# EasyEDA Pro project 舵机电源.epro

# Schematic steering_engine_driver
Board Name: steering_engine_driver; Create Date: 2025-04-19; Page Name: P1; Project Name: wheel_legged_robot_v7.0; Schematic Name: steering_engine_driver; Update Date: 2025-04-19; Company: 嘉立创EDA; Page Size: A4; Version: V1.0
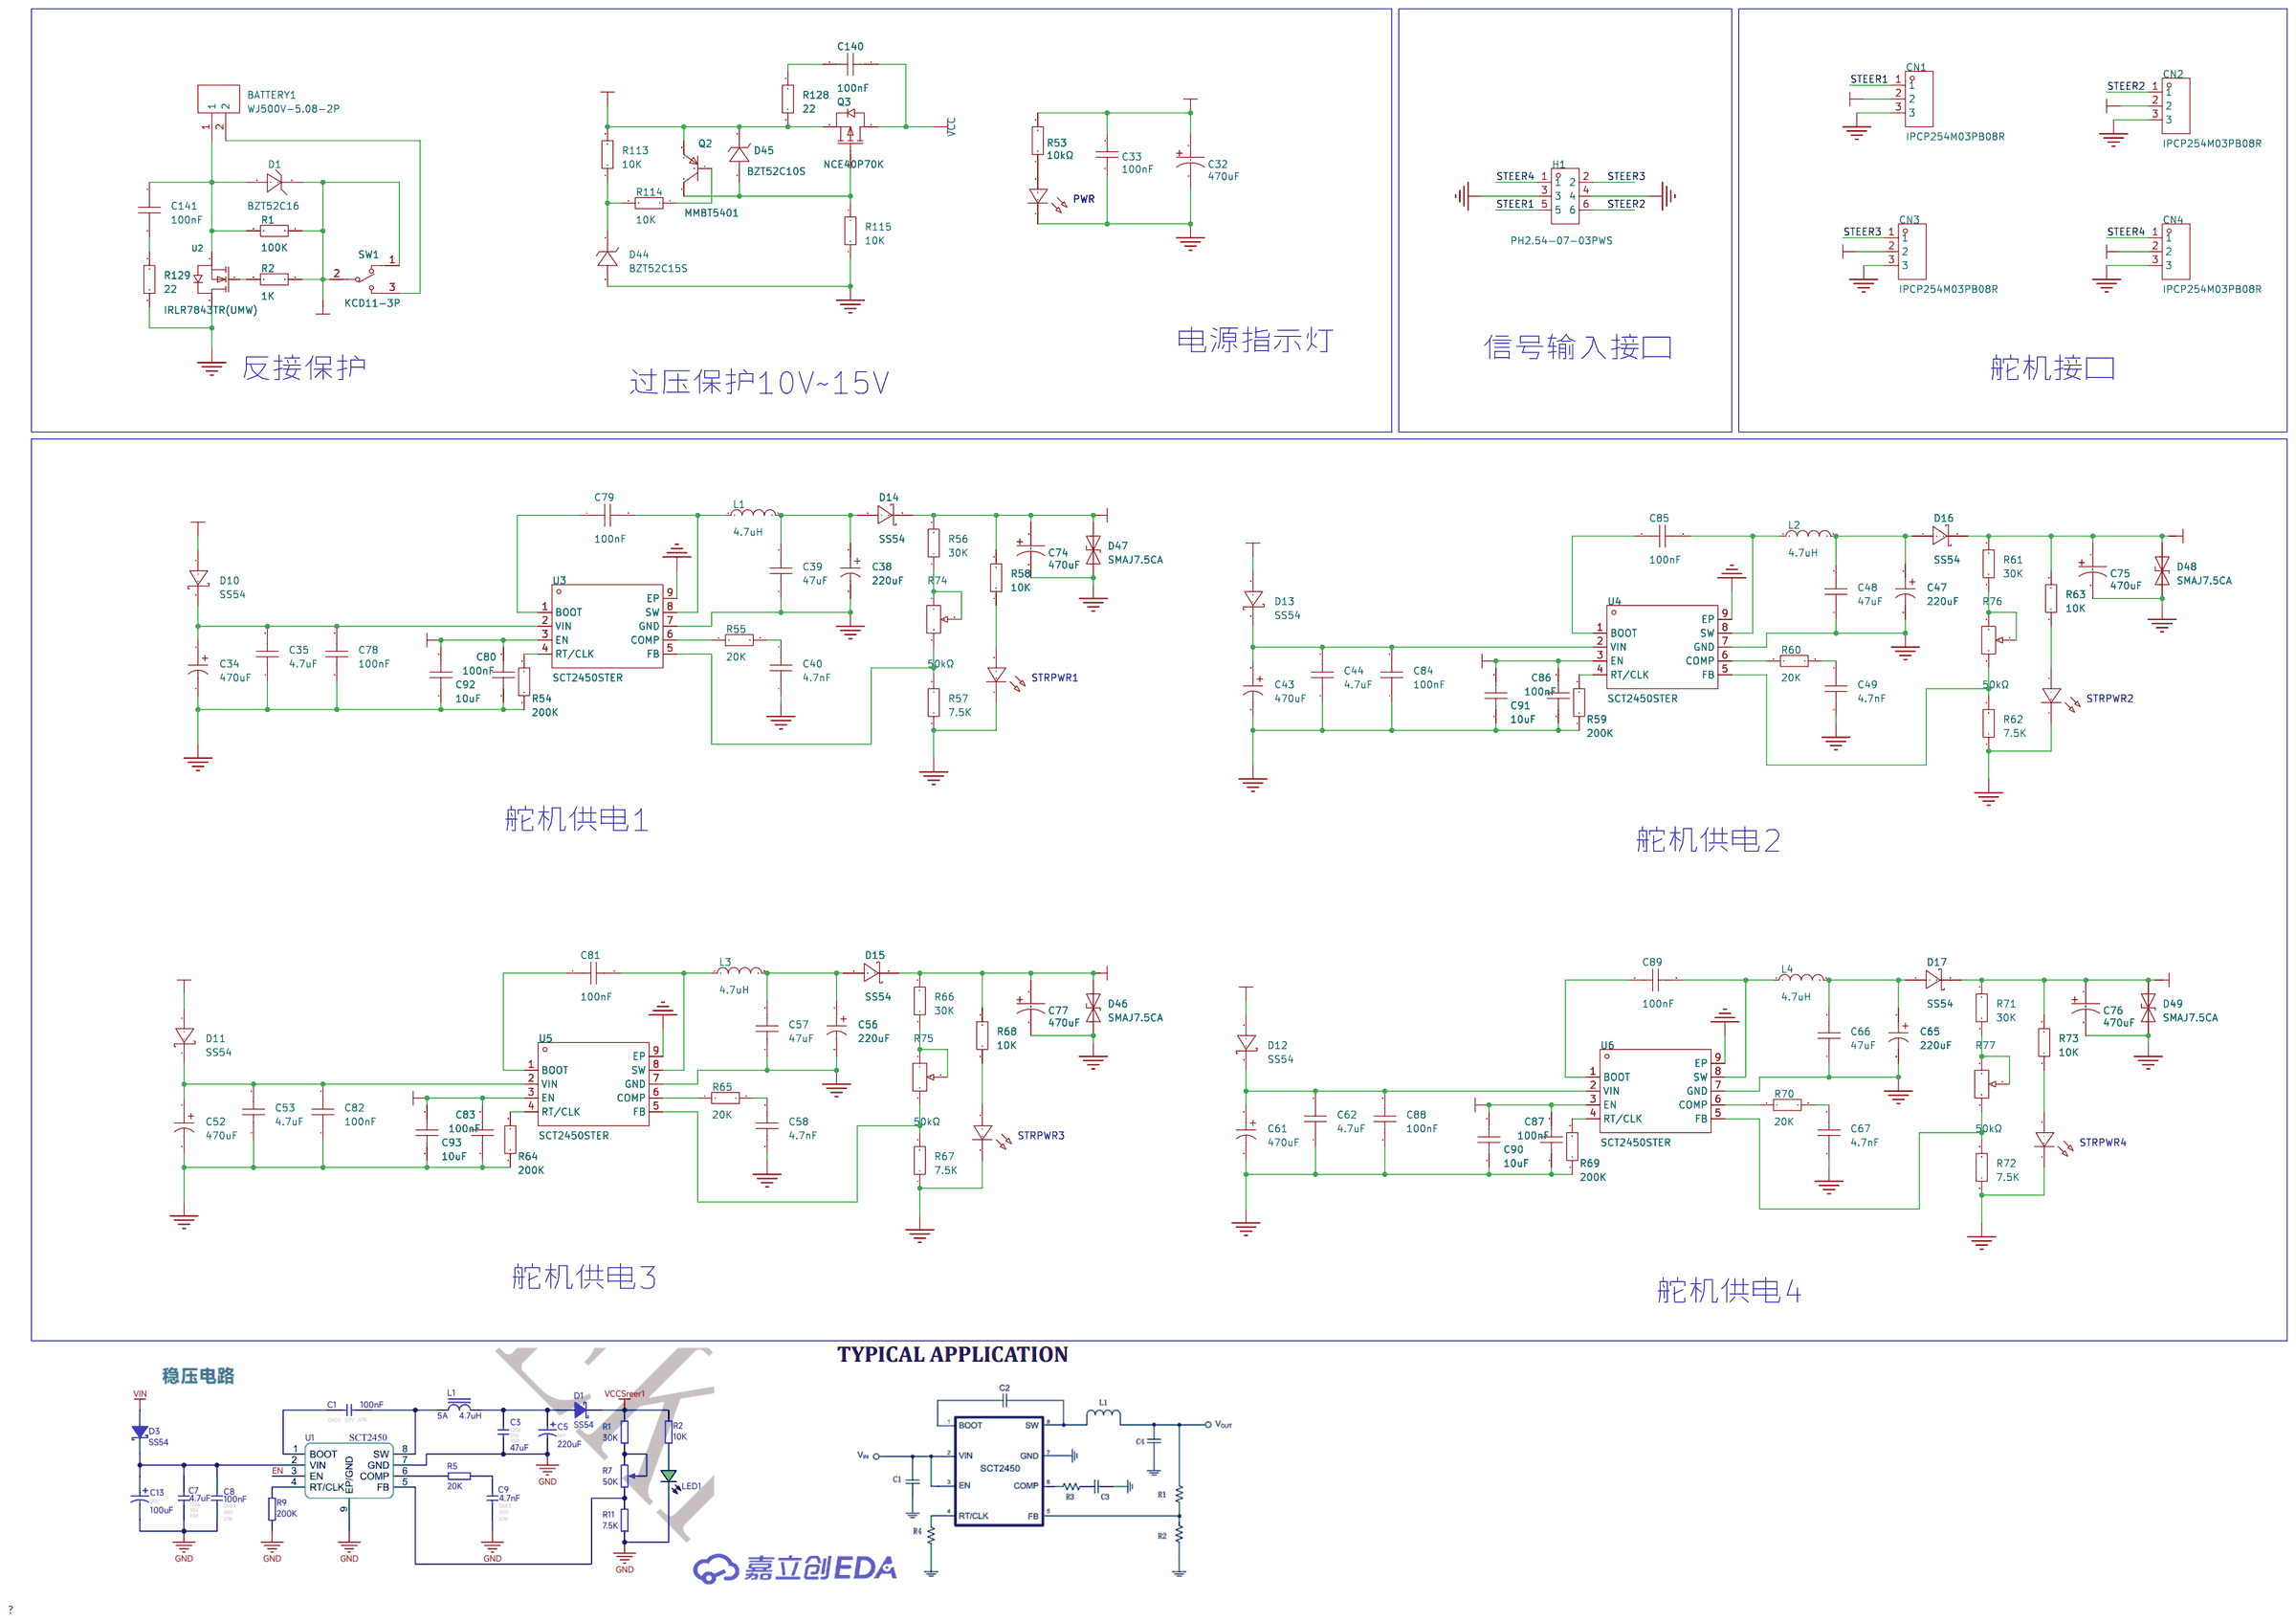
[diagram p0: schematic sheet]

## Parts
BATTERY1  WJ500V-5.08-2P  [CONN-TH_2P-P5.00_WJ500V-5.08-2P]
C32  470uF  [CAP-TH_BD8.0-P3.50-D0.6-FD]
C33  100nF  [C0805]
C34  470uF  [CAP-SMD_BD8.0-L8.3-W8.3-FD]
C35  4.7uF  [C1206]
C38  220uF  [CAP-SMD_BD8.0-L8.3-W8.3-FD]
C39  47uF  [C1206]
C40  4.7nF  [C0603]
C43  470uF  [CAP-SMD_BD8.0-L8.3-W8.3-FD]
C44  4.7uF  [C1206]
C47  220uF  [CAP-SMD_BD8.0-L8.3-W8.3-FD]
C48  47uF  [C1206]
C49  4.7nF  [C0603]
C52  470uF  [CAP-SMD_BD8.0-L8.3-W8.3-FD]
C53  4.7uF  [C1206]
C56  220uF  [CAP-SMD_BD8.0-L8.3-W8.3-FD]
C57  47uF  [C1206]
C58  4.7nF  [C0603]
C61  470uF  [CAP-SMD_BD8.0-L8.3-W8.3-FD]
C62  4.7uF  [C1206]
C65  220uF  [CAP-SMD_BD8.0-L8.3-W8.3-FD]
C66  47uF  [C1206]
C67  4.7nF  [C0603]
C74  470uF  [CAP-TH_BD8.0-P3.50-D0.6-FD]
C75  470uF  [CAP-TH_BD8.0-P3.50-D0.6-FD]
C76  470uF  [CAP-TH_BD8.0-P3.50-D0.6-FD]
C77  470uF  [CAP-TH_BD8.0-P3.50-D0.6-FD]
C78  100nF  [C0603]
C79  100nF  [C0603]
C80  100nF  [C0603]
C81  100nF  [C0603]
C82  100nF  [C0603]
C83  100nF  [C0603]
C84  100nF  [C0603]
C85  100nF  [C0603]
C86  100nF  [C0603]
C87  100nF  [C0603]
C88  100nF  [C0603]
C89  100nF  [C0603]
C90  10uF  [C0603]
C91  10uF  [C0603]
C92  10uF  [C0603]
C93  10uF  [C0603]
C140  100nF  [C0603]
C141  100nF  [C0603]
CN1  IPCP254M03PB08R  [HDR-TH_3P-P2.54-H-M-W10.4]
CN2  IPCP254M03PB08R  [HDR-TH_3P-P2.54-H-M-W10.4]
CN3  IPCP254M03PB08R  [HDR-TH_3P-P2.54-H-M-W10.4]
CN4  IPCP254M03PB08R  [HDR-TH_3P-P2.54-H-M-W10.4]
D1  BZT52C16  [SOD-123_L2.7-W1.6-LS3.7-RD]
D10  SS54  [SMA_L4.4-W2.8-LS5.4-R-RD]
D11  SS54  [SMA_L4.4-W2.8-LS5.4-R-RD]
D12  SS54  [SMA_L4.4-W2.8-LS5.4-R-RD]
D13  SS54  [SMA_L4.4-W2.8-LS5.4-R-RD]
D14  SS54  [SMA_L4.4-W2.8-LS5.4-R-RD]
D15  SS54  [SMA_L4.4-W2.8-LS5.4-R-RD]
D16  SS54  [SMA_L4.4-W2.8-LS5.4-R-RD]
D17  SS54  [SMA_L4.4-W2.8-LS5.4-R-RD]
D44  BZT52C15S  [SOD-323_L1.7-W1.3-LS2.6-RD]
D45  BZT52C10S  [SOD-323_L1.7-W1.3-LS2.6-RD]
D46  SMAJ7.5CA  [SMA_L4.4-W2.6-LS5.0-BI]
D47  SMAJ7.5CA  [SMA_L4.4-W2.6-LS5.0-BI]
D48  SMAJ7.5CA  [SMA_L4.4-W2.6-LS5.0-BI]
D49  SMAJ7.5CA  [SMA_L4.4-W2.6-LS5.0-BI]
H1  PH2.54-07-03PWS  [HDR-TH_6P-P2.54-H-M-R2-C3-S2.54-W12.3-N]
L1  4.7uH  [IND-SMD_L7.4-W6.6]
L2  4.7uH  [IND-SMD_L7.4-W6.6]
L3  4.7uH  [IND-SMD_L7.4-W6.6]
L4  4.7uH  [IND-SMD_L7.4-W6.6]
PWR  -  [LED_0805]
Q2  MMBT5401  [SOT-23-3_L2.9-W1.3-P1.90-LS2.4-BR]
Q3  NCE40P70K  [TO-252-2_L6.6-W6.1-P4.57-LS9.9-TL-CW]
R1  100K  [R0805]
R2  1K  [R0805]
R53  10kΩ  [R0805]
R54  200K  [R0603]
R55  20K  [R0603]
R56  30K  [R0603]
R57  7.5K  [R0603]
R58  10K  [R0603]
R59  200K  [R0603]
R60  20K  [R0603]
R61  30K  [R0603]
R62  7.5K  [R0603]
R63  10K  [R0603]
R64  200K  [R0603]
R65  20K  [R0603]
R66  30K  [R0603]
R67  7.5K  [R0603]
R68  10K  [R0603]
R69  200K  [R0603]
R70  20K  [R0603]
R71  30K  [R0603]
R72  7.5K  [R0603]
R73  10K  [R0603]
R74  50kΩ  [RES-ADJ-TH_3P-L7.1-W6.9-P2.50-L_3362P]
R75  50kΩ  [RES-ADJ-TH_3P-L7.1-W6.9-P2.50-L_3362P]
R76  50kΩ  [RES-ADJ-TH_3P-L7.1-W6.9-P2.50-L_3362P]
R77  50kΩ  [RES-ADJ-TH_3P-L7.1-W6.9-P2.50-L_3362P]
R113  10K  [R0805]
R114  10K  [R0805]
R115  10K  [R0805]
R128  22  [R0603]
R129  22  [R0603]
STRPWR1  -  [LED_0805]
STRPWR2  -  [LED_0805]
STRPWR3  -  [LED_0805]
STRPWR4  -  [LED_0805]
SW1  KCD11-3P  [KCD11-3P]
U2  IRLR7843TR(UMW)  [TO-252-2_L6.5-W6.1-P4.58-LS10.0-BL]
U3  SCT2450STER  [ESOP-8_L4.9-W3.9-P1.27-LS6.0-BL-EP]
U4  SCT2450STER  [ESOP-8_L4.9-W3.9-P1.27-LS6.0-BL-EP]
U5  SCT2450STER  [ESOP-8_L4.9-W3.9-P1.27-LS6.0-BL-EP]
U6  SCT2450STER  [ESOP-8_L4.9-W3.9-P1.27-LS6.0-BL-EP]

## Library data of the parts
BATTERY1 = WJ500V-5.08-2P: 结构:1x2P;间距:5.08mm;颜色:绿色;安装方式:直插;额定电流:18A;额定电压:250V;排数:1;线规 - AWG:14~30;线规 - 平方毫米:2.5;每排PIN数:2;工作温度范围:-40℃~+105℃;; Supplier: LCSC; Manufacturer: KANGNEX(康奈克斯电气); Supplier Part: C8465; JLCPCB Part Class: 扩展库; LCSC Part Name: 5.08mm 1x2P 排数:1 每排P数:2 直插; Supplier Footprint: 插件,P=5.08mm; Datasheet: https://atta.szlcsc.com/upload/public/pdf/source/20191225/C8465_02D34CE5B5B4A53DF5891601D97FA9F4.pdf; Structure: 1x2P; Pitch: 5.08mm; Color: 绿色; Mounting Style: 直插; Current Rating (Max): 18A; Voltage Rating (Max): 250V; Number of Pins: 2P; Number of Rows: 1; Wire Gauge - AWG: 14~30; Wire Gauge - mm2: 2.5; Number of PINs Per Row: 2; Operating Temperature Range: -40℃~+105℃
C32 C74-C77 = 470uF: link: https://atta.szlcsc.com/upload/public/pdf/source/20151029/1457707523808.pdf; 3DModel: CAP-TH_D8.0-H8.0-P3.50; Supplier: LCSC; Manufacturer: HONOR(荣誉); Manufacturer Part: HS1C477M0811PC; Supplier Part: C42238; JLCPCB Part Class: Extended Part
C33 = 100nF: link: https://item.szlcsc.com/373011.html; 3DModel: C0805_L2.0-W1.3-H1.3; Supplier: LCSC; Manufacturer Part: CC0805KRX7R9BB104; Manufacturer: YAGEO(国巨); Supplier Part: C49678; JLCPCB Part Class: Basic Part
C34 C38 C43 C47 C52 C56 C61 C65 = RST470UF25V032: 容值:470uF;精度:±20%;额定电压:25V;纹波电流:280mA@120Hz;等效串联电阻:-;; LCSC Part Name: 470uF ±20% 25V; Supplier Part: C4747956; Manufacturer: KNSCHA(科尼盛); Supplier Footprint: SMD,D8xL10.5mm; JLCPCB Part Class: 扩展库; Datasheet: https://atta.szlcsc.com/upload/public/pdf/source/20220722/DDA0AF558EEAFF68270B01FAD3D9C996.pdf; Supplier: LCSC; Tolerance: ±20%; Rated Voltage: 25V; Ripple Current: 280mA@120Hz; φD: 8mm; L: 10.5mm; Lifetime @ Temp: 2000hrs@105℃; Operating Temperature: -40℃~+105℃
C35 C39 C44 C48 C53 C57 C62 C66 = CAP_1206: Supplier Footprint: 1206
C40 C49 C58 C67 C78-C93 = CAP_0603: Supplier Footprint: 0603
C140 C141 = CAP_0603: Supplier Footprint: 0805
CN1-CN4 = IPCP254M03PB08R: 插针结构:1x3P;间距:2.54mm;圆针/方针:方针;安装类型:弯插;排数:单排;总PIN位数:3P;额定电流:3A;额定电压:-;塑高:2.5mm;触头材质:黄铜;触头镀层:金;工作温度范围:-40℃~+105℃;颜色:黑色;; LCSC Part Name: 1x3P 间距:2.54mm 方针 弯插; Supplier Part: C22395593; Manufacturer: INCP; Supplier Footprint: 弯插,P=2.54mm; JLCPCB Part Class: 扩展库; Datasheet: https://atta.szlcsc.com/upload/public/pdf/source/20240509/0D0900A9017CC8912FD60234744B7849.pdf; Supplier: LCSC; Pin Structure: 1x3P; Pitch: 2.54mm; Circluar Pins/Square Pins: 方针; Mounting Type: 弯插; Number of Rows: 单排; Number of Pins: 3P; Current Rating (Max): 3A; Insulation Height: 2.5mm; Contact Material: 黄铜; Contact Plating: 金; Operating Temperature Range: -40℃~+105℃; Color: 黑色
D1 = BZT52C16_C266570: 二极管配置:独立式;稳压值(标称值):16V;稳压值(范围):15.3V~17.1V;功率:500mW;精度:-;; Supplier Part: C266570; Manufacturer: BORN(伯恩半导体); Supplier Footprint: SOD-123; JLCPCB Part Class: 扩展库; Datasheet: https://atta.szlcsc.com/upload/public/pdf/source/20180820/C271262_D2D0F24DD5A81EAE2A6B8B493A94E64A.pdf; Supplier: LCSC; Diode Configuration: 独立式; Zener Voltage (Nom): 16V; Reverse Leakage Current (Ir): 100nA@11.2V; Zener Voltage (Range): 15.3V~17.1V; Power Dissipation: 500mW; Zener Impedance (Zzt): 40Ω
D10-D17 = SS54_C22452: 二极管配置:独立式;正向压降(Vf):550mV@5A;直流反向耐压(Vr):40V;整流电流:5A;; LCSC Part Name: 电压:40V 电流:5A; Supplier Part: C22452; Manufacturer: MDD(辰达半导体); Supplier Footprint: SMA(DO-214AC); JLCPCB Part Class: 基础库; Datasheet: https://atta.szlcsc.com/upload/public/pdf/source/20240710/73DFBB65C1883B895E62D589679033DF.pdf; Supplier: LCSC; Diode Configuration: 独立式; Forward Voltage (Vf@If): 550mV@5A; Reverse Voltage (Vr): 40V; Rectified Current: 5A; Reverse Leakage Current (Ir): 1mA@40V
D44 = BZT52C15S_C19077448: 二极管配置:独立式;稳压值(标称值):15V;稳压值(范围):13.8V~15.6V;功率(Pd):200mW;; Supplier Part: C19077448; Manufacturer: 宏迦橙; Supplier Footprint: SOD-323; JLCPCB Part Class: 扩展库; Datasheet: https://atta.szlcsc.com/upload/public/pdf/source/20231117/06CD1C2A69B3FFC97FEAE4263E1B2FE9.pdf; Supplier: LCSC; Diode Configuration: 独立式; Zener Voltage (Nom): 15V; Reverse Leakage Current (Ir): 100nA@10.5V; Zener Voltage (Range): 13.8V~15.6V; Power Dissipation: 200mW; Zener Impedance (Zzt): 30Ω
D45 = BZT52C10S_C19077446: 二极管配置:独立式;稳压值(标称值):10V;稳压值(范围):9.4V~10.6V;耗散功率(Pd):200mW;; Supplier Part: C19077446; Manufacturer: 宏嘉诚; Supplier Footprint: SOD-323; Datasheet: https://atta.szlcsc.com/upload/public/pdf/source/20250106/7E1D90346C4882705F28E5010261A625.pdf; Supplier: LCSC; Diode Configuration: 独立式; Zener Voltage(Nom): 10V; Reverse Leakage Current (Ir): 200nA@7V; Zener Voltage(Range): 9.4V~10.6V; Pd - Power Dissipation(Pd): 200mW; Impedance(Zzt): 20Ω
D46-D49 = SMAJ7.5CA: 反向截止电压(Vrwm):7.5V;最大钳位电压:12.9V;峰值脉冲电流(Ipp):31A;击穿电压:8.33V;; LCSC Part Name: 双向TVS 7.5V截止 31A峰值脉冲; Supplier Part: C356752; Manufacturer: JJW(捷捷微); Supplier Footprint: SMA(DO-214AC); Datasheet: https://atta.szlcsc.com/upload/public/pdf/source/20190118/C364660_B64EB57815AD6306F3CC88F8ECD7A3CF.pdf; Supplier: LCSC; Reverse Stand-Off Voltage (Vrwm): 7.5V; Maximum Clamping Voltage: 12.9V; Peak Pulse Current (Ipp): 31A; Breakdown Voltage: 8.33V; Reverse Leakage Current (Ir): 50uA; Type: TVS
H1 = PH2.54-07-03PWS: 插针结构:2x3P;间距:2.54mm;圆针/方针:方针;安装类型:弯插;排数:双排;总PIN位数:6P;配合针长度:6mm;塑高:2.5mm;触头材质:黄铜;工作温度范围:-40℃~+105℃;颜色:黑色;; LCSC Part Name: 2x3P 间距:2.54mm 方针 弯插; Supplier Part: C7501617; Manufacturer: XUNPU(讯普); Supplier Footprint: 弯插,P=2.54mm; Datasheet: https://atta.szlcsc.com/upload/public/pdf/source/20230815/3BBD1229DF6C13ABF62022728673B9BB.pdf; Supplier: LCSC; Pin Structure: 2x3P; Pitch: 2.54mm; Circluar Pins/Square Pins: 方针; Mounting Type: 弯插; Number of Rows: 双排; Number of Pins: 6P; Length of Mating Pin: 6mm; Insulation Height: 2.5mm; Contact Material: 黄铜; Operating Temperature Range: -40℃~+105℃; Color: 黑色
L1-L4 = HMS0603-4R7: 电感值:4.7uH;精度:-;额定电流:5.5A;饱和电流(Isat):6.5A;类型:一体成型电感;; LCSC Part Name: 4.7uH 6.5A; Supplier Part: C967698; Manufacturer: 增益; Supplier Footprint: SMD,7.4x6.6mm; JLCPCB Part Class: 扩展库; Datasheet: https://atta.szlcsc.com/upload/public/pdf/source/20210225/C967698_0CB36CDEAF6345E0CAE8D00497A63C4A.pdf; Supplier: LCSC; Rated Current: 5.5A; Saturation Current (Isat): 6.5A; DC Resistance (DCR): 38mΩ; Type: 一体成型电感
PWR STRPWR1-STRPWR4 = LED_0805-G: Supplier Footprint: 0805
Q2 = MMBT5401_C7420356: 晶体管类型:PNP;集电极电流(Ic):600mA;集射极击穿电压(Vceo):160V;耗散功率(Pd):300mW;直流电流增益(hFE):100@10mA,5.0V;; LCSC Part Name: hFE:100-300 MMBT5401; Supplier Part: C7420356; Manufacturer: 宏嘉诚; Supplier Footprint: SOT-23; JLCPCB Part Class: 扩展库; Datasheet: https://atta.szlcsc.com/upload/public/pdf/source/20250205/4872AD2745041BE7314444031B314746.pdf; Supplier: LCSC; type: PNP; Current - Collector(Ic): 600mA; Collector - Emitter Voltage VCEO: 160V; Pd - Power Dissipation: 300mW; DC Current Gain: 100@10mA,5.0V; Transition frequency(fT): 100MHz; Current - Collector Cutoff: 100nA; Vce Saturation(VCE(sat)): 200mV; Operating Temperature: -55℃~+150℃
Q3 = NCE40P70K: 类型:1个P沟道;漏源电压(Vdss):40V;连续漏极电流(Id):70A;导通电阻(RDS(on)):10mΩ@10V,20A;耗散功率(Pd):130W;阈值电压(Vgs(th)):1.9V;; LCSC Part Name: 1个P沟道 耐压:40V 电流:70A; Supplier Part: C130101; Manufacturer: NCE(无锡新洁能); Supplier Footprint: TO-252-2(DPAK); JLCPCB Part Class: 扩展库; Datasheet: https://atta.szlcsc.com/upload/public/pdf/source/20170919/C130101_1505787178833976874.pdf; Supplier: LCSC; Type: 1个P沟道; Drain to Source Voltage: 40V; Current - Continuous Drain(Id): 70A; RDS(on): 10mΩ@10V,20A; Pd - Power Dissipation: 130W; Gate Threshold Voltage (Vgs(th)@Id): 1.9V; Input Capacitance(Ciss@Vds): 5.38nF@20V; Reverse Transfer Capacitance (Crss@Vds): 500pF; Operating Temperature: -55℃~+150℃
R1 R2 R113-R115 = Res_0805: Supplier Footprint: 0805
R53 = 10kΩ: link: https://item.szlcsc.com/142685.html; 3DModel: R0805_L2.0-W1.3-H0.6; Supplier: LCSC; Manufacturer: UNI-ROYAL(厚声); Manufacturer Part: 0805W8F1002T5E; Supplier Part: C17414; JLCPCB Part Class: Basic Part
R54-R73 = Res_0603: Supplier Footprint: 0603
R74-R77 = 3362P-1-503: 阻值:50kΩ;精度:±10%;; LCSC Part Name: 50kΩ ±10%; Supplier Part: C118910; Manufacturer: BOCHEN(博晨); Supplier Footprint: 插件; JLCPCB Part Class: 扩展库; Datasheet: https://atta.szlcsc.com/upload/public/pdf/source/20171114/C118910_15106326554621117400.pdf; Supplier: LCSC; Tolerance: ±10%
R128 R129 = Res_0603: Supplier Footprint: 0805
SW1 = KCD11-3P
U2 = IRLR7843TR(UMW): Supplier Part: C7499399; Manufacturer: UMW(友台半导体); Supplier Footprint: TO-252; Datasheet: https://atta.szlcsc.com/upload/public/pdf/source/20231109/092A516F619CFFA4C30AC0DEF7D9D9F4.pdf; Supplier: LCSC
U3-U6 = SCT2450STER: 功能类型:降压型;工作电压:3.8V~36V;输出电流:5A;; LCSC Part Name: 3.8V-36V输入，5A输出，高效率同步降压DC-DC转换器; Supplier Part: C509400; Manufacturer: SCT(芯洲科技); Supplier Footprint: ESOP-8; JLCPCB Part Class: 扩展库; Datasheet: https://atta.szlcsc.com/upload/public/pdf/source/20200407/C509400_EDF779A672A59398CFBA9E95FA584FEC.pdf; Supplier: LCSC; Function: 降压型; Input Voltage: 3.8V~36V; Output Current: 5A; Switching Frequency: 100kHz~1.1MHz; Operating Temperature: -40℃~+125℃@(TJ); Synchronous Rectification: 是; Number of Outputs: 1; Switch tube (built-in/external): 内置

## Nets
GND: C32.2 C33.1 C34.2 C35.1 C38.2 C39.1 C40.1 C43.2 C44.1 C47.2 C48.1 C49.1 C52.2 C53.1 C56.2 C57.1 C58.1 C61.2 C62.1 C65.2 C66.1 C67.1 C74.2 C75.2 C76.2 C77.2 C78.1 C80.1 C82.1 C83.1 C84.1 C86.1 C87.1 C88.1 C90.1 C91.1 C92.1 C93.1 CN1.3 CN2.3 CN3.3 CN4.3 D44.2(A) D46.1(K) D47.1(K) D48.1(K) D49.1(K) H1.3 H1.4 PWR.1(C) R54.1 R57.1 R59.1 R62.1 R64.1 R67.1 R69.1 R72.1 R115.2 R129.2 STRPWR1.1(C) STRPWR2.1(C) STRPWR3.1(C) STRPWR4.1(C) U2.2(D) U3.7(GND) U3.9(EP) U4.7(GND) U4.9(EP) U5.7(GND) U5.9(EP) U6.7(GND) U6.9(EP)
VCC: C32.1 C33.2 C80.2 C83.2 C86.2 C87.2 C90.2 C91.2 C92.2 C93.2 C140.1 D10.1(A) D11.1(A) D12.1(A) D13.1(A) Q3.2(D) R53.2 U3.3(EN) U4.3(EN) U5.3(EN) U6.3(EN)
VCCBAT: D1.1 D45.1(K) Q2.2(E) Q3.3(S) R1.2 R2.2 R113.2 R128.2 SW1.1 SW1.2
VCCSTEER1: C74.1 CN1.2 D14.2(K) D47.2(A) R56.2 R58.2
VCCSTEER2: C75.1 CN2.2 D16.2(K) D48.2(A) R61.2 R63.2
VCCSTEER3: C77.1 CN3.2 D15.2(K) D46.2(A) R66.2 R68.2
VCCSTEER4: C76.1 CN4.2 D17.2(K) D49.2(A) R71.2 R73.2
STEER1: CN1.1 H1.5
STEER2: CN2.1 H1.6
STEER3: CN3.1 H1.2
STEER4: CN4.1 H1.1
$1N401: PWR.2(A) R53.1
$1N405: R2.1 U2.1(G)
$1N407: BATTERY1.1 C141.1 D1.2 R1.1 U2.3(S)
$1N408: BATTERY1.2 SW1.3
$1N1540: R54.2 U3.4(RT/CLK)
$1N1581: C79.1 U3.1(BOOT)
$1N1587: C79.2 L1.1 U3.8(SW)
$1N1783: C38.1 C39.2 D14.1(A) L1.2
$1N1881: R55.1 U3.6(COMP)
$1N2036: C40.2 R55.2
$1N2040: R57.2 R74.3 U3.5(FB)
$1N2151: R58.1 STRPWR1.2(A)
$1N2280: R56.1 R74.1 R74.2
$1N2319: C34.1 C35.2 C78.2 D10.2(K) U3.2(VIN)
$1N3136: R59.2 U4.4(RT/CLK)
$1N3138: C85.1 U4.1(BOOT)
$1N3142: C85.2 L2.1 U4.8(SW)
$1N3154: C47.1 C48.2 D16.1(A) L2.2
$1N3159: R60.1 U4.6(COMP)
$1N3163: C49.2 R60.2
$1N3165: R62.2 R76.3 U4.5(FB)
$1N3182: R63.1 STRPWR2.2(A)
$1N3186: R61.1 R76.1 R76.2
$1N3195: C43.1 C44.2 C84.2 D13.2(K) U4.2(VIN)
$1N3910: R64.2 U5.4(RT/CLK)
$1N3912: C81.1 U5.1(BOOT)
$1N3916: C81.2 L3.1 U5.8(SW)
$1N3928: C56.1 C57.2 D15.1(A) L3.2
$1N3933: R65.1 U5.6(COMP)
$1N3937: C58.2 R65.2
$1N3939: R67.2 R75.3 U5.5(FB)
$1N3956: R68.1 STRPWR3.2(A)
$1N3960: R66.1 R75.1 R75.2
$1N3969: C52.1 C53.2 C82.2 D11.2(K) U5.2(VIN)
$1N4684: R69.2 U6.4(RT/CLK)
$1N4686: C89.1 U6.1(BOOT)
$1N4690: C89.2 L4.1 U6.8(SW)
$1N4702: C65.1 C66.2 D17.1(A) L4.2
$1N4707: R70.1 U6.6(COMP)
$1N4711: C67.2 R70.2
$1N4713: R72.2 R77.3 U6.5(FB)
$1N4730: R73.1 STRPWR4.2(A)
$1N4734: R71.1 R77.1 R77.2
$1N4743: C61.1 C62.2 C88.2 D12.2(K) U6.2(VIN)
$1N12422: D44.1(K) R113.1 R114.2
$1N12432: D45.2(A) Q2.3(C) Q3.1(G) R115.1
$1N12444: Q2.1(B) R114.1
$1N14719: C140.2 R128.1
$1N14792: C141.2 R129.1

## Notes on the sheet
- 电源指示灯
- 信号输入接口
- 反接保护
- 舵机接口
- 过压保护10V~15V
- 舵机供电1
- 舵机供电2
- 舵机供电3
- 舵机供电4

# Board steering_engine_driver
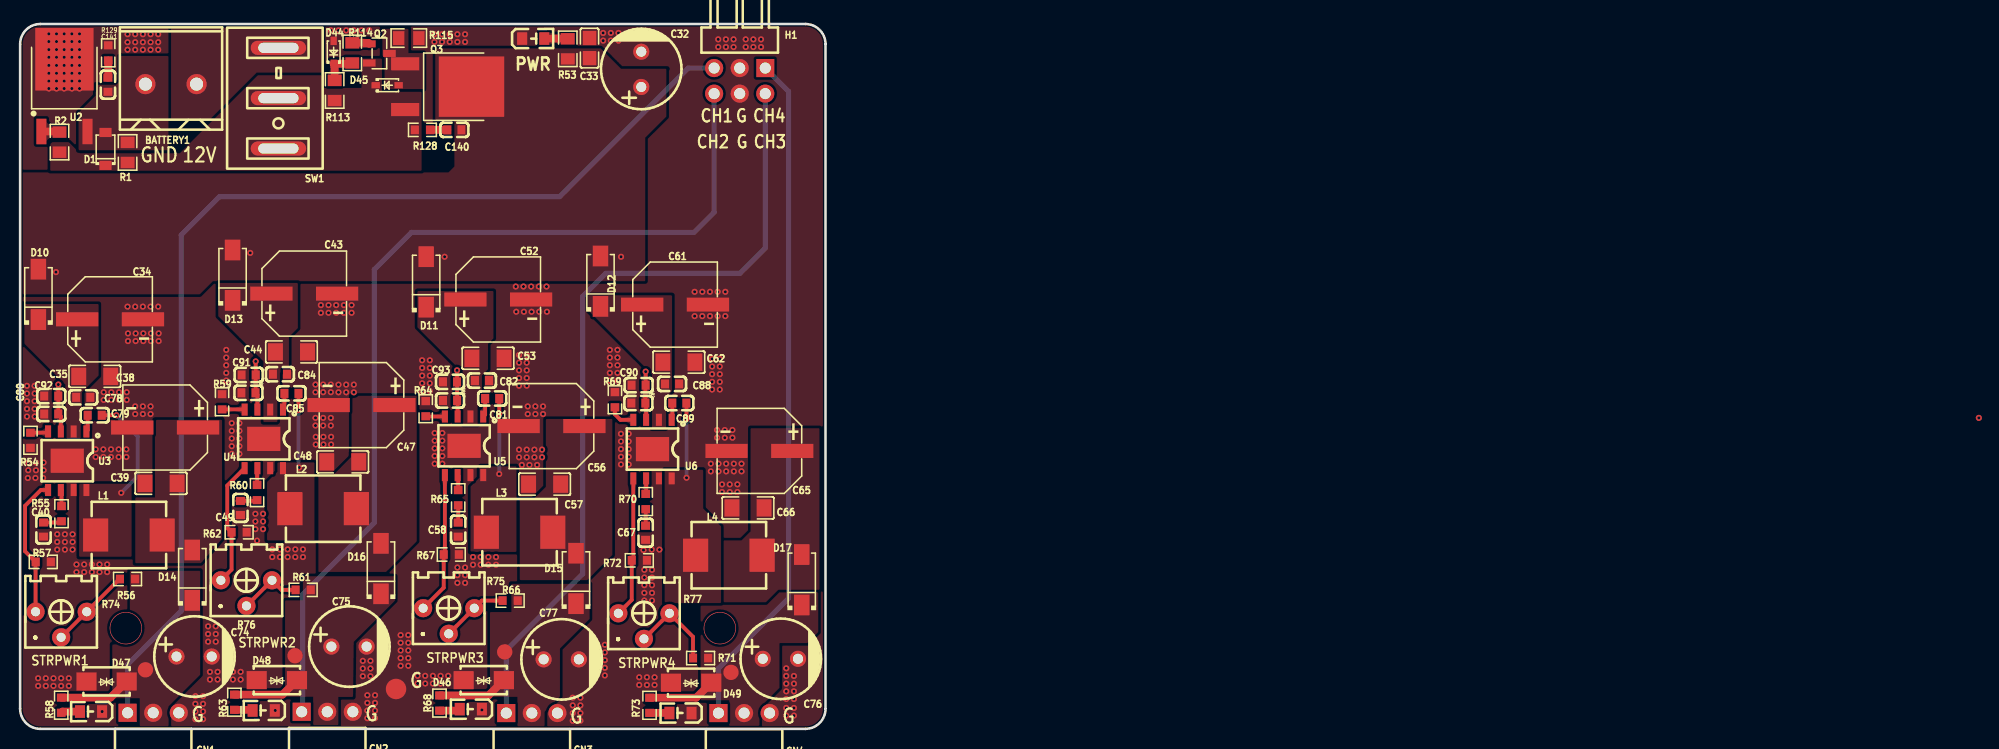
[diagram p1: board, top side]
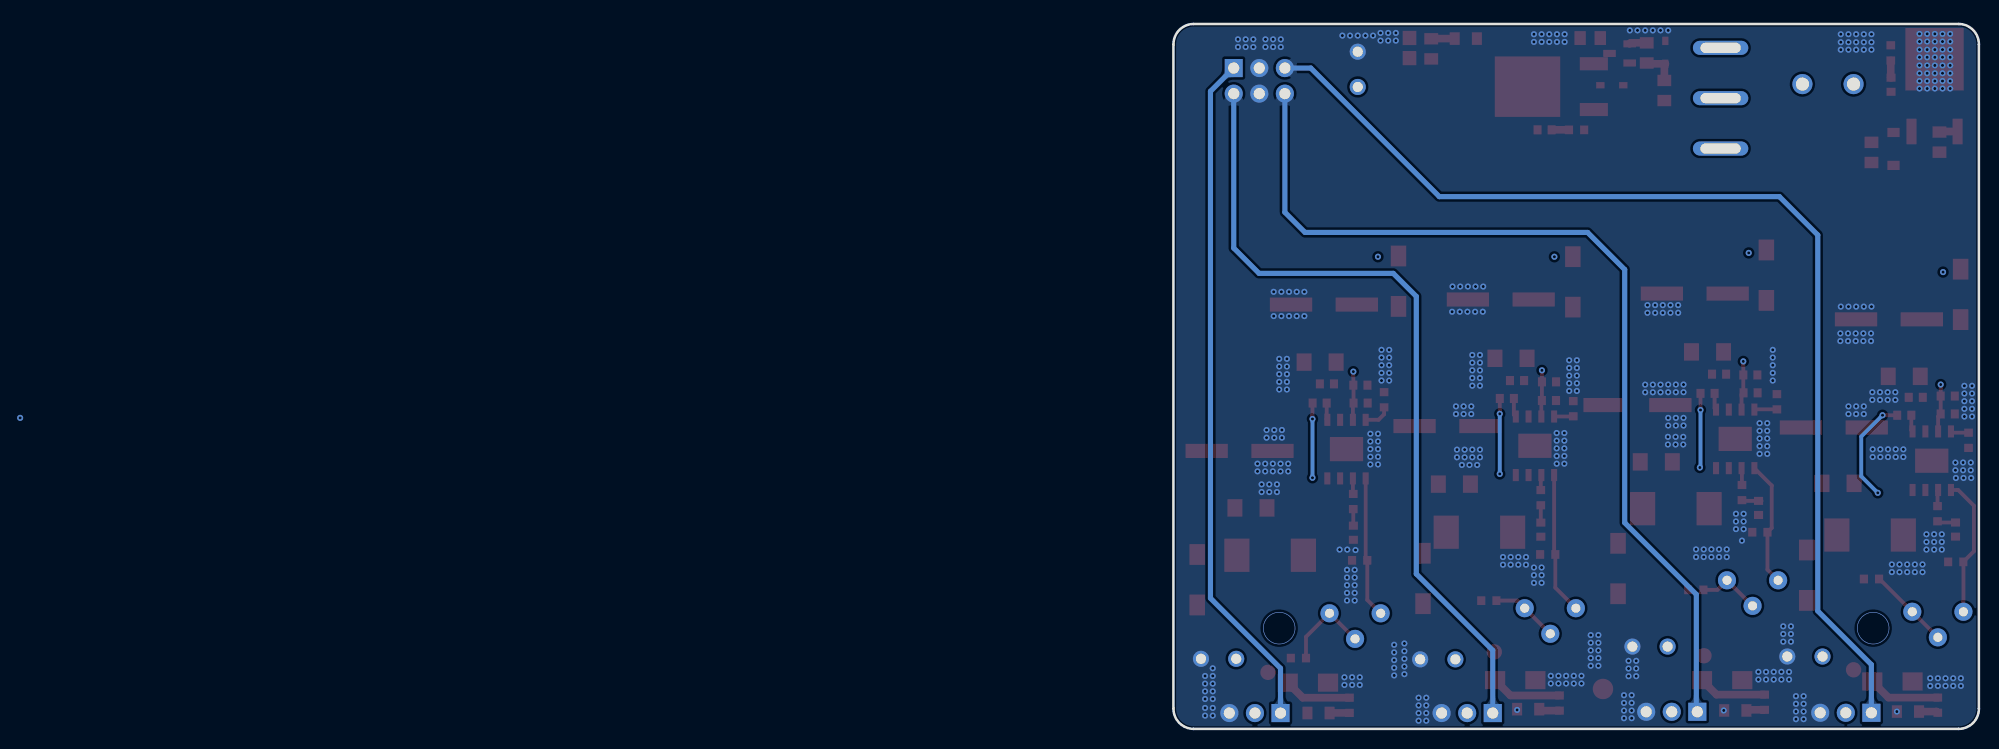
[diagram p2: board, bottom side, seen from below]

Outline 80 x 70 mm; copper layers: Top Layer, GND, VCCBAT, Bottom Layer. Coordinates in mm from the lower left corner of the outline.
Outline path: 0,68 0,2 arc(0.59,0.59) 2,0 78,0 arc(79.41,0.59) 80,2 80,68 arc(79.41,69.41) 78,70 2,70 arc(0.59,69.41) 0,68
Stack: Top Layer 0.035mm 外层铜厚1oz / Dielectric1 0.2104mm 7628 RC49% 8.6mil / GND 0.0152mm 内层铜厚 / Dielectric2 1.065mm 1.1mm H/HOZ Copper / VCCBAT 0.0152mm 内层铜厚 / Dielectric3 0.2104mm 7628 RC49% 8.6mil / Bottom Layer 0.035mm 外层铜厚1oz

## Design rules (mm)
template: 自定义配置
spacing copperThickness1oz (default): track to track 0.102, other pairs 0.152 to 0.3
spacing copperThickness2oz: track to track 0.203, other pairs 0.152 to 0.3
track width copperThickness1oz (default): min 0.127, default 0.254, max 2.54
track width copperThickness2oz: min 0.203, default 0.254, max 2.54
differential pair differentialPair (default): width min 0.127, default 0.254, max 2.54; gap min 0.152, default 0.152
via viaSize (default): diameter min 0.5, default 0.61, max 10; hole min 0.3, default 0.305, max 6.3

## Placement (name value [footprint] x y rotation side)
BATTERY1  WJ500V-5.08-2P  [CONN-TH_2P-P5.00_WJ500V-5.08-2P]  14.99 64.03 0 top
C32  470uF  [CAP-TH_BD8.0-P3.50-D0.6-FD]  61.7 65.5 90 top
C33  100nF  [C0805]  56.56 67.61 270 top
C34  470uF  [CAP-SMD_BD8.0-L8.3-W8.3-FD]  8.93 40.67 0 top
C35  4.7uF  [C1206]  7.41 35.01 180 top
C38  220uF  [CAP-SMD_BD8.0-L8.3-W8.3-FD]  14.41 29.93 180 top
C39  47uF  [C1206]  13.99 24.38 0 top
C40  4.7nF  [C0603]  2.32 19.79 90 top
C43  470uF  [CAP-SMD_BD8.0-L8.3-W8.3-FD]  28.22 43.22 0 top
C44  4.7uF  [C1206]  26.95 37.44 180 top
C47  220uF  [CAP-SMD_BD8.0-L8.3-W8.3-FD]  33.91 32.15 180 top
C48  47uF  [C1206]  32.04 26.51 0 top
C49  4.7nF  [C0603]  21.88 21.94 90 top
C52  470uF  [CAP-SMD_BD8.0-L8.3-W8.3-FD]  47.49 42.64 0 top
C53  4.7uF  [C1206]  46.47 36.8 180 top
C56  220uF  [CAP-SMD_BD8.0-L8.3-W8.3-FD]  52.78 30.07 180 top
C57  47uF  [C1206]  52.1 24.3 0 top
C58  4.7nF  [C0603]  43.51 19.78 90 top
C61  470uF  [CAP-SMD_BD8.0-L8.3-W8.3-FD]  65.06 42.13 0 top
C62  4.7uF  [C1206]  65.44 36.42 180 top
C65  220uF  [CAP-SMD_BD8.0-L8.3-W8.3-FD]  73.43 27.6 180 top
C66  47uF  [C1206]  72.3 21.94 0 top
C67  4.7nF  [C0603]  62.13 19.48 90 top
C74  470uF  [CAP-TH_BD8.0-P3.50-D0.6-FD]  17.28 7.19 0 top
C75  470uF  [CAP-TH_BD8.0-P3.50-D0.6-FD]  32.67 8.17 0 top
C76  470uF  [CAP-TH_BD8.0-P3.50-D0.6-FD]  75.52 6.96 0 top
C77  470uF  [CAP-TH_BD8.0-P3.50-D0.6-FD]  53.75 6.9 0 top
C78  100nF  [C0603]  6.27 32.92 180 top
C79  100nF  [C0603]  7.41 31.15 0 top
C80  100nF  [C0603]  3.09 31.27 0 top
C81  100nF  [C0603]  46.89 32.81 0 top
C82  100nF  [C0603]  45.87 34.59 180 top
C83  100nF  [C0603]  42.7 32.61 0 top
C84  100nF  [C0603]  25.81 35.22 180 top
C85  100nF  [C0603]  26.95 33.32 0 top
C86  100nF  [C0603]  22.68 33.37 0 top
C87  100nF  [C0603]  61.41 32.36 0 top
C88  100nF  [C0603]  64.76 34.26 180 top
C89  100nF  [C0603]  65.48 32.36 0 top
C90  10uF  [C0603]  61.43 34.13 0 top
C91  10uF  [C0603]  22.7 35.15 0 top
C92  10uF  [C0603]  3.09 33.05 0 top
C93  10uF  [C0603]  42.7 34.46 0 top
C140  100nF  [C0603]  43.13 59.49 180 top
C141  100nF  [C0603]  8.72 63.97 90 top
CN1  IPCP254M03PB08R  [HDR-TH_3P-P2.54-H-M-W10.4]  13.22 1.6 0 top
CN2  IPCP254M03PB08R  [HDR-TH_3P-P2.54-H-M-W10.4]  30.51 1.7 0 top
CN3  IPCP254M03PB08R  [HDR-TH_3P-P2.54-H-M-W10.4]  50.83 1.57 0 top
CN4  IPCP254M03PB08R  [HDR-TH_3P-P2.54-H-M-W10.4]  71.91 1.57 0 top
D1  BZT52C16  [SOD-123_L2.7-W1.6-LS3.7-RD]  8.48 57.59 90 top
D10  SS54  [SMA_L4.4-W2.8-LS5.4-R-RD]  1.81 43.15 90 top
D11  SS54  [SMA_L4.4-W2.8-LS5.4-R-RD]  40.33 44.39 90 top
D12  SS54  [SMA_L4.4-W2.8-LS5.4-R-RD]  57.65 44.46 90 top
D13  SS54  [SMA_L4.4-W2.8-LS5.4-R-RD]  21.1 45.06 90 top
D14  SS54  [SMA_L4.4-W2.8-LS5.4-R-RD]  17.1 15.26 90 top
D15  SS54  [SMA_L4.4-W2.8-LS5.4-R-RD]  55.22 14.94 90 top
D16  SS54  [SMA_L4.4-W2.8-LS5.4-R-RD]  35.84 15.92 90 top
D17  SS54  [SMA_L4.4-W2.8-LS5.4-R-RD]  77.64 14.81 90 top
D44  BZT52C15S  [SOD-323_L1.7-W1.3-LS2.6-RD]  31.14 67.19 90 top
D45  BZT52C10S  [SOD-323_L1.7-W1.3-LS2.6-RD]  36.46 63.92 0 top
D46  SMAJ7.5CA  [SMA_L4.4-W2.6-LS5.0-BI]  46.05 4.84 0 top
D47  SMAJ7.5CA  [SMA_L4.4-W2.6-LS5.0-BI]  8.59 4.71 0 top
D48  SMAJ7.5CA  [SMA_L4.4-W2.6-LS5.0-BI]  25.5 4.84 0 top
D49  SMAJ7.5CA  [SMA_L4.4-W2.6-LS5.0-BI]  66.65 4.59 0 top
H1  PH2.54-07-03PWS  [HDR-TH_6P-P2.54-H-M-R2-C3-S2.54-W12.3-N]  71.48 64.36 180 top
L1  4.7uH  [IND-SMD_L7.4-W6.6]  10.8 19.25 0 top
L2  4.7uH  [IND-SMD_L7.4-W6.6]  30.1 21.87 0 top
L3  4.7uH  [IND-SMD_L7.4-W6.6]  49.61 19.53 0 top
L4  4.7uH  [IND-SMD_L7.4-W6.6]  70.4 17.24 0 top
NOREF  -  [Pad_e1759]  37.34 3.96 0 top
NOREF#2  -  [Pad_e1771]  27.31 7.26 0 top
NOREF#3  -  [Pad_e1770]  48.13 7.64 0 top
NOREF#4  -  [Pad_e1769]  70.61 5.61 0 top
NOREF#5  -  [Pad_e1772]  12.45 5.87 0 top
PWR  -  [LED_0805]  51.01 68.55 0 top
Q2  MMBT5401  [SOT-23-3_L2.9-W1.3-P1.90-LS2.4-BR]  35.69 67.08 180 top
Q3  NCE40P70K  [TO-252-2_L6.6-W6.1-P4.57-LS9.9-TL-CW]  41.54 63.78 0 top
R1  100K  [R0805]  10.67 57.24 270 top
R2  1K  [R0805]  3.91 58.27 270 top
R53  10kΩ  [R0805]  54.4 67.53 270 top
R54  200K  [R0603]  1.03 28.66 90 top
R55  20K  [R0603]  4.11 21.37 270 top
R56  30K  [R0603]  10.67 14.88 0 top
R57  7.5K  [R0603]  2.3 16.58 180 top
R58  10K  [R0603]  4.08 2.35 90 top
R59  200K  [R0603]  20.06 32.48 270 top
R60  20K  [R0603]  23.53 23.47 270 top
R61  30K  [R0603]  28.11 13.8 0 top
R62  7.5K  [R0603]  21.75 19.53 180 top
R63  10K  [R0603]  21.28 2.65 90 top
R64  200K  [R0603]  40.29 31.8 270 top
R65  20K  [R0603]  43.51 22.96 270 top
R66  30K  [R0603]  48.68 12.74 0 top
R67  7.5K  [R0603]  42.83 17.32 180 top
R68  10K  [R0603]  41.66 2.56 90 top
R69  200K  [R0603]  59.08 32.68 270 top
R70  20K  [R0603]  62.14 22.58 270 top
R71  30K  [R0603]  67.59 7.03 0 top
R72  7.5K  [R0603]  61.5 16.73 180 top
R73  10K  [R0603]  62.52 2.34 90 top
R74  50kΩ  [RES-ADJ-TH_3P-L7.1-W6.9-P2.50-L_3362P]  4.07 10.36 180 top
R75  50kΩ  [RES-ADJ-TH_3P-L7.1-W6.9-P2.50-L_3362P]  42.57 10.71 180 top
R76  50kΩ  [RES-ADJ-TH_3P-L7.1-W6.9-P2.50-L_3362P]  22.48 13.48 180 top
R77  50kΩ  [RES-ADJ-TH_3P-L7.1-W6.9-P2.50-L_3362P]  61.96 10.21 180 top
R113  10K  [R0805]  31.24 63.4 270 top
R114  10K  [R0805]  32.99 67.13 270 top
R115  10K  [R0805]  38.61 68.6 0 top
R128  22  [R0603]  39.96 59.49 180 top
R129  22  [R0603]  8.75 67.13 90 top
STRPWR1  -  [LED_0805]  6.99 1.72 180 top
STRPWR2  -  [LED_0805]  24.14 1.83 180 top
STRPWR3  -  [LED_0805]  44.72 1.96 180 top
STRPWR4  -  [LED_0805]  65.54 1.58 180 top
SW1  -  [KCD11-3P]  25.65 62.63 90 top
U2  IRLR7843TR(UMW)  [TO-252-2_L6.5-W6.1-P4.58-LS10.0-BL]  4.4 62.91 0 top
U3  SCT2450STER  [ESOP-8_L4.9-W3.9-P1.27-LS6.0-BL-EP]  4.68 26.63 180 top
U4  SCT2450STER  [ESOP-8_L4.9-W3.9-P1.27-LS6.0-BL-EP]  24.2 28.8 180 top
U5  SCT2450STER  [ESOP-8_L4.9-W3.9-P1.27-LS6.0-BL-EP]  44.1 28.11 180 top
U6  SCT2450STER  [ESOP-8_L4.9-W3.9-P1.27-LS6.0-BL-EP]  62.81 27.78 180 top

## Footprints (pads in the part's own frame, mm; a bottom-side part is the same pattern mirrored in y, then rotated)
C0603
  rect 0.8x0.9 smd: 1(-0.7,0) 2(0.7,0)
C0805
  rect 1.41x1.35 smd: 1(-1,0) 2(1,0)
C1206
  rect 1.485x1.728 smd: 1(-1.593,0) 2(1.593,0)
CAP-SMD_BD8.0-L8.3-W8.3-FD
  rect 4.2x1.4 smd: 1(-3.267,0) 2(3.267,0)
CAP-TH_BD8.0-P3.50-D0.6-FD
  round 1.6 hole 1: 1(-1.75,0) 2(1.75,0)
CONN-TH_2P-P5.00_WJ500V-5.08-2P
  round 2 hole 1.3: 1(-2.54,0) 2(2.54,0)
ESOP-8_L4.9-W3.9-P1.27-LS6.0-BL-EP
  rect 0.6x1.2 smd: 1(-1.905,-2.909) 2(-0.635,-2.909) 3(0.635,-2.909) 4(1.905,-2.909) 5(1.905,2.909) 6(0.635,2.909) 7(-0.635,2.909) 8(-1.905,2.909)
  rect 3.3x2.4 smd: 9(0,0)
HDR-TH_3P-P2.54-H-M-W10.4
  rect 1.8x1.8 hole 1.1: 1(-2.54,0)
  round 1.8 hole 1.1: 2(0,0) 3(2.54,0)
HDR-TH_6P-P2.54-H-M-R2-C3-S2.54-W12.3-N
  rect 1.778x1.8 hole 1.1: 1(-2.54,-1.27)
  round 1.8 hole 1.1: 2(-2.54,1.27) 3(0,-1.27) 4(0,1.27) 5(2.54,-1.27) 6(2.54,1.27)
IND-SMD_L7.4-W6.6
  rect 2.5x3.3 smd: 1(-3.302,0) 2(3.302,0)
KCD11-3P
  oval 1.4x5.5 hole 1x4: 1(-5,0) 2(0,0) 3(5,0)
LED_0805
  rect 1x1.25 smd: 1(-1.15,0.005) 2(1.05,0.005)
Pad_e1759
  round 2.032 smd: TP1(0,0)
Pad_e1769
  round 1.524 smd: TP2(0,0)
Pad_e1770
  round 1.524 smd: TP3(0,0)
Pad_e1771
  round 1.524 smd: TP4(0,0)
Pad_e1772
  round 1.524 smd: TP5(0,0)
R0603
  rect 0.806x0.864 smd: 1(-0.753,0) 2(0.753,0)
R0805
  rect 1.133x1.377 smd: 1(-1,0) 2(1,0)
RES-ADJ-TH_3P-L7.1-W6.9-P2.50-L_3362P
  round 1.8 hole 0.9: 1(-2.54,-1.27) 2(0,1.27) 3(2.54,-1.27)
SMA_L4.4-W2.6-LS5.0-BI
  rect 2x1.8 smd: 1(-2,0) 2(2,0)
SMA_L4.4-W2.8-LS5.4-R-RD
  rect 2.062x1.539 smd: 1(2.503,0) 2(-2.503,0)
SOD-123_L2.7-W1.6-LS3.7-RD
  rect 0.91x1.22 smd: 1(-1.635,0) 2(1.635,0)
SOD-323_L1.7-W1.3-LS2.6-RD
  rect 0.83x0.63 smd: 1(-1.14,0) 2(1.14,0)
SOT-23-3_L2.9-W1.3-P1.90-LS2.4-BR
  rect 1.25x0.7 smd: 1(1,-0.95) 2(1,0.95) 3(-1,0)
TO-252-2_L6.5-W6.1-P4.58-LS10.0-BL
  rect 1x2.54 smd: 1(-2.29,-3.587) 3(2.29,-3.587)
  rect 5.8x6.2 smd: 2(0,3.587)
TO-252-2_L6.6-W6.1-P4.57-LS9.9-TL-CW
  rect 2.8x1.3 smd: 1(-3.292,2.273) 3(-3.292,-2.273)
  rect 6.5x6 smd: 2(3.292,0)

## Nets
As in the schematic, except:
GND: C32.2 C33.1 C34.2 C35.1 C38.2 C39.1 C40.1 C43.2 C44.1 C47.2 C48.1 C49.1 C52.2 C53.1 C56.2 C57.1 C58.1 C61.2 C62.1 C65.2 C66.1 C67.1 C74.2 C75.2 C76.2 C77.2 C78.1 C80.1 C82.1 C83.1 C84.1 C86.1 C87.1 C88.1 C90.1 C91.1 C92.1 C93.1 CN1.3 CN2.3 CN3.3 CN4.3 D44.2 D46.1 D47.1 D48.1 D49.1 H1.3 H1.4 NOREF.TP1 PWR.1 R54.1 R57.1 R59.1 R62.1 R64.1 R67.1 R69.1 R72.1 R115.2 R129.2 STRPWR1.1 STRPWR2.1 STRPWR3.1 STRPWR4.1 U2.2 U3.7 U3.9 U4.7 U4.9 U5.7 U5.9 U6.7 U6.9
VCCSTEER1: C74.1 CN1.2 D14.2 D47.2 NOREF#5.TP5 R56.2 R58.2
VCCSTEER2: C75.1 CN2.2 D16.2 D48.2 NOREF#2.TP4 R61.2 R63.2
VCCSTEER3: C77.1 CN3.2 D15.2 D46.2 NOREF#3.TP3 R66.2 R68.2
VCCSTEER4: C76.1 CN4.2 D17.2 D49.2 NOREF#4.TP2 R71.2 R73.2

## Via types
v1: diameter 3.2, hole 3.1, Top Layer to Bottom Layer, 2 vias
v2: diameter 0.61, hole 0.305, Top Layer to Bottom Layer, 508 vias

## Routing (per net, layer and track width the routed paths; a pad name or vN(x,y) marks a point on that pad's centre or on a via; arc(x,y) is an arc through that point)
GND:
  vias: v2(0.68,34.07) v2(0.68,33.31) v2(0.68,32.54) v2(0.68,31.78) v2(0.68,31.02) v2(0.81,26.45) v2(0.81,25.69) v2(0.76,24.92) v2(1.44,34.07) v2(1.44,33.31) v2(1.44,32.54) v2(1.44,31.78) v2(1.44,31.02) v2(1.52,24.92) v2(1.57,26.45) v2(1.57,25.69) v2(1.79,5.03) v2(1.79,4.26) v2(2.33,26.45) v2(2.33,25.69) v2(2.29,24.92) v2(2.55,5.03) v2(2.55,4.26) v2(2.85,69.02) v2(2.85,68.26) v2(2.85,67.46) v2(2.85,66.7) v2(2.85,65.89) v2(2.85,65.11) v2(2.85,64.34) v2(2.85,63.59) v2(3.31,5.03) v2(3.31,4.26) v2(3.61,69.02) v2(3.61,68.26) v2(3.61,67.46) v2(3.61,66.7) v2(3.61,65.89) v2(3.61,65.11) v2(3.61,64.34) v2(3.61,63.59) v2(3.68,19.33) v2(3.68,18.56) v2(3.68,17.8) v2(4.07,5.03) v2(4.07,4.26) v2(4.37,69.02) v2(4.37,68.26) v2(4.37,67.46) v2(4.37,66.7) v2(4.37,65.89) v2(4.37,65.11) v2(4.37,64.34) v2(4.37,63.59) v2(4.44,19.33) v2(4.44,18.56) v2(4.44,17.8) v2(4.84,5.03) v2(4.84,4.26) v2(5.14,69.02) v2(5.14,68.26) v2(5.14,67.46) v2(5.14,66.7) v2(5.14,65.89) v2(5.14,65.11) v2(5.14,64.34) v2(5.14,63.59) v2(5.21,19.33) v2(5.21,18.56) v2(5.21,17.8) v2(5.6,16.33) v2(5.6,15.57) v2(5.9,69.02) v2(5.9,68.26) v2(5.9,67.46) v2(5.9,66.7) v2(5.9,65.89) v2(5.9,65.11) v2(5.9,64.34) v2(5.9,63.59) v2(6.36,16.33) v2(6.36,15.57) v2(7.12,16.33) v2(7.12,15.57) v2(7.5,27.76) v2(7.5,27) v2(7.88,16.33) v2(7.88,15.57) v2(8.14,1.72) v2(8.3,33.43) v2(8.3,32.67) v2(8.26,27.76) v2(8.26,27) v2(8.65,16.33) v2(8.65,15.57) v2(9.03,27.76) v2(9.03,27) v2(9.06,33.43) v2(9.06,32.67) v2(9.82,33.43) v2(9.82,32.67) v2(9.79,27.76) v2(9.79,27) v2(10.58,33.43) v2(10.58,32.67) v2(10.55,27.76) v2(10.55,27) v2(10.67,68.98) v2(10.67,68.19) v2(10.67,67.45) v2(10.67,41.93) v2(10.71,39.27) v2(10.71,38.51) v2(11.43,68.98) v2(11.43,68.19) v2(11.43,67.45) v2(11.43,41.93) v2(11.43,32.03) v2(11.43,31.27) v2(11.47,39.27) v2(11.47,38.51) v2(12.19,68.98) v2(12.19,68.19) v2(12.19,67.45) v2(12.19,41.93) v2(12.24,39.27) v2(12.24,38.51) v2(12.19,32.03) v2(12.19,31.27) v2(12.95,68.98) v2(12.95,68.19) v2(12.95,67.45) v2(12.95,41.93) v2(13,39.27) v2(13,38.51) v2(12.95,32.03) v2(12.95,31.27) v2(13.72,68.98) v2(13.72,68.19) v2(13.72,67.45) v2(13.72,41.93) v2(13.76,39.27) v2(13.76,38.51) v2(17.41,3.25) v2(17.41,2.49) v2(17.41,1.72) v2(17.41,0.96) v2(18.17,3.25) v2(18.17,2.49) v2(18.17,1.72) v2(18.17,0.96) v2(18.67,10.18) v2(18.67,9.42) v2(18.67,8.66) v2(18.85,5.66) v2(18.85,4.9) v2(19.43,10.18) v2(19.43,9.42) v2(19.43,8.66) v2(19.62,5.66) v2(19.62,4.9) v2(20.38,5.66) v2(20.38,4.9) v2(20.47,37.64) v2(20.47,36.88) v2(20.47,36.11) v2(20.47,35.35) v2(20.47,34.59) v2(21.02,30.36) v2(21.02,29.6) v2(21.02,28.83) v2(21.02,28.07) v2(21.02,27.31) v2(21.14,5.66) v2(21.14,4.9) v2(21.78,30.36) v2(21.78,29.6) v2(21.78,28.83) v2(21.78,28.07) v2(21.78,27.31) v2(21.9,5.66) v2(21.9,4.9) v2(23.37,21.36) v2(23.37,20.6) v2(23.37,19.83) v2(23.53,18.69) v2(24.13,21.36) v2(24.13,20.6) v2(24.13,19.83) v2(25.05,17.83) v2(25.05,17.06) v2(25.34,1.83) v2(25.81,17.83) v2(25.81,17.06) v2(26.57,17.83) v2(26.57,17.06) v2(27.33,17.83) v2(27.33,17.06) v2(28.09,17.83) v2(28.09,17.06) v2(29.34,34.19) v2(29.34,33.43) v2(29.34,30.88) v2(29.34,30.12) v2(29.36,29) v2(29.36,28.24) v2(29.87,42.08) v2(29.87,41.32) v2(30.1,34.19) v2(30.1,33.43) v2(30.1,30.88) v2(30.1,30.12) v2(30.13,29) v2(30.13,28.24) v2(30.63,42.08) v2(30.63,41.32) v2(30.86,69.36) v2(30.86,34.19) v2(30.86,33.43) v2(30.86,30.88) v2(30.86,30.12) v2(30.89,29) v2(30.89,28.24) v2(31.4,42.08) v2(31.4,41.32) v2(31.62,69.36) v2(31.62,34.19) v2(31.62,33.42) v2(32.16,42.08) v2(32.16,41.32) v2(32.38,69.36) v2(32.38,34.19) v2(32.38,33.42) v2(32.92,42.08) v2(32.92,41.32) v2(33.15,69.36) v2(33.15,34.19) v2(33.15,33.42) v2(33.91,69.36) v2(34.04,6.75) v2(34.04,5.99) v2(34.04,5.23) v2(34.49,3.34) v2(34.49,2.58) v2(34.49,1.82) v2(34.49,1.06) v2(34.67,69.36) v2(34.8,6.75) v2(34.8,5.99) v2(34.8,5.23) v2(35.25,3.34) v2(35.25,2.58) v2(35.25,1.82) v2(35.25,1.06) v2(37.79,9.31) v2(37.79,8.55) v2(37.79,7.79) v2(37.79,7.03) v2(37.79,6.26) v2(38.56,9.31) v2(38.56,8.55) v2(38.56,7.79) v2(38.56,7.03) v2(38.56,6.26) v2(39.48,5.27) v2(39.48,4.5) v2(39.93,36.61) v2(39.93,35.84) v2(39.93,35.08) v2(39.93,34.32) v2(39.93,33.56) v2(40.24,5.27) v2(40.24,4.5) v2(40.69,36.61) v2(40.69,35.84) v2(40.69,35.08) v2(40.69,34.32) v2(40.69,33.56) v2(41,5.27) v2(41,4.5) v2(41.15,68.98) v2(41.15,68.22) v2(41.18,29.38) v2(41.18,28.62) v2(41.18,27.86) v2(41.18,27.1) v2(41.18,26.33) v2(41.76,5.27) v2(41.76,4.5) v2(41.91,68.98) v2(41.91,68.22) v2(41.94,29.38) v2(41.94,28.62) v2(41.94,27.86) v2(41.94,27.1) v2(41.94,26.33) v2(42.52,5.27) v2(42.52,4.5) v2(42.67,68.98) v2(42.67,68.22) v2(43.43,68.98) v2(43.43,68.22) v2(43.43,16.03) v2(43.43,15.26) v2(43.43,14.5) v2(44.2,68.98) v2(44.2,68.22) v2(44.2,16.03) v2(44.2,15.26) v2(44.2,14.5) v2(44.99,17.06) v2(44.99,16.3) v2(45.75,17.06) v2(45.75,16.3) v2(45.87,1.88) v2(46.51,17.06) v2(46.51,16.3) v2(47.27,17.06) v2(47.27,16.3) v2(49.23,43.93) v2(49.28,41.42) v2(49.56,37.13) v2(49.56,36.37) v2(49.56,35.61) v2(49.56,34.84) v2(49.56,34.08) v2(49.56,27.73) v2(49.56,26.97) v2(49.83,26.21) v2(50,43.93) v2(50.04,41.42) v2(50.32,37.13) v2(50.32,36.37) v2(50.32,35.61) v2(50.32,34.84) v2(50.32,34.08) v2(50.32,27.73) v2(50.32,26.97) v2(50.42,32.03) v2(50.42,31.27) v2(50.59,26.21) v2(50.76,43.93) v2(50.8,41.42) v2(51.08,27.73) v2(51.08,26.97) v2(51.18,32.03) v2(51.18,31.27) v2(51.36,26.21) v2(51.52,43.93) v2(51.56,41.42) v2(51.84,27.73) v2(51.84,26.97) v2(51.94,32.03) v2(51.94,31.27) v2(52.28,43.93) v2(52.32,41.42) v2(54.89,3.09) v2(54.89,2.33) v2(54.89,1.57) v2(54.89,0.81) v2(55.65,3.09) v2(55.65,2.33) v2(55.65,1.57) v2(55.65,0.81) v2(57.06,8.48) v2(57.06,7.72) v2(57.06,6.96) v2(57.06,6.19) v2(57.06,5.43) v2(57.91,69.11) v2(57.91,68.35) v2(58.08,8.35) v2(58.08,7.59) v2(58.08,6.83) v2(58.08,6.07) v2(58.08,5.31) v2(58.57,37.64) v2(58.57,36.88) v2(58.57,36.11) v2(58.57,35.35) v2(58.57,34.59) v2(58.67,69.11) v2(58.67,68.35) v2(59.34,37.64) v2(59.34,36.88) v2(59.34,36.11) v2(59.34,35.35) v2(59.34,34.59) v2(59.44,69.11) v2(59.44,68.35) v2(59.68,29.31) v2(59.68,28.55) v2(59.68,27.78) v2(59.68,27.02) v2(59.68,26.26) v2(60.18,68.85) v2(60.44,29.31) v2(60.44,28.55) v2(60.44,27.78) v2(60.44,27.02) v2(60.44,26.26) v2(60.94,68.85) v2(61.5,5.12) v2(61.5,4.36) v2(61.7,68.85) v2(61.92,17.76) v2(62,15.79) v2(62,15.03) v2(62,14.27) v2(62,13.51) v2(62,12.75) v2(62.26,5.12) v2(62.26,4.36) v2(62.46,68.85) v2(62.74,17.8) v2(62.76,15.79) v2(62.76,15.03) v2(62.76,14.27) v2(62.76,13.51) v2(62.76,12.75) v2(63.02,5.12) v2(63.02,4.36) v2(63.22,68.85) v2(63.5,17.8) v2(67,43.4) v2(67,40.99) v2(67.76,43.4) v2(67.76,40.99) v2(68.52,43.4) v2(68.52,40.99) v2(68.61,26.33) v2(68.61,25.57) v2(68.73,36.75) v2(68.73,35.99) v2(68.73,35.22) v2(68.73,34.46) v2(68.73,33.7) v2(69.23,29.68) v2(69.23,28.92) v2(69.34,68.48) v2(69.34,67.71) v2(69.28,43.4) v2(69.28,40.99) v2(69.37,26.33) v2(69.37,25.57) v2(69.5,36.75) v2(69.5,35.99) v2(69.5,35.22) v2(69.5,34.46) v2(69.5,33.7) v2(69.72,24.28) v2(69.72,23.52) v2(70.05,43.4) v2(70.05,40.99) v2(69.99,29.68) v2(69.99,28.92) v2(70.1,68.48) v2(70.1,67.71) v2(70.13,26.33) v2(70.13,25.57) v2(70.49,24.28) v2(70.49,23.52) v2(70.76,29.68) v2(70.76,28.92) v2(70.87,68.48) v2(70.87,67.71) v2(70.89,26.33) v2(70.89,25.57) v2(71.25,24.28) v2(71.25,23.52) v2(71.66,26.33) v2(71.66,25.57) v2(72.07,68.48) v2(72.07,67.71) v2(72.83,68.48) v2(72.83,67.71) v2(73.6,68.48) v2(73.6,67.71) v2(76.1,6.01) v2(76.1,5.25) v2(76.1,4.49) v2(76.1,3.73) v2(76.1,2.97) v2(76.1,2.08) v2(76.1,1.31) v2(76.86,5.25) v2(76.86,4.49) v2(76.86,3.73) v2(76.86,2.97) v2(76.86,2.08) v2(76.86,1.31)
VCC: length 65.5
  Top Layer w0.381: U3.3 4.05,31.02 C80.2 C92.2 v2(3.79,34.19) ; v2(62.13,35.48) C90.2 62.11,34.11 C87.2 62.18,32.29 U6.3 ; v2(23.4,36.49) C91.2 23.4,33.39 C86.2 23.57,33.18 U4.3 ; v2(43.4,35.61) C93.2 43.4,34.46 C83.2 43.46,32.55 U5.3
  VCCBAT w0.381: v2(62.13,35.48) 62.13,44.44 v2(59.69,46.89) ; v2(22.86,47.27) 23.4,46.73 v2(23.4,36.49) ; v2(43.4,35.61) 43.4,45.65 v2(42.16,46.89) ; v2(3.56,45.36) 3.79,45.13 v2(3.79,34.19)
VCCSTEER1: length 7.2
  Top Layer w0.762: R58.2 8.98,3.1 D47.2
VCCSTEER2: length 6.8
  Top Layer w0.762: D48.2 26.06,3.4 R63.2
VCCSTEER3: length 7
  Top Layer w0.762: R68.2 46.53,3.32 D46.2
VCCSTEER4: length 6.7
  Top Layer w0.762: 62.52,3.09 67.16,3.09 D49.2
(no net):
  vias: v1(10.5,10) v1(69.5,10) v2(194.56,30.88)
STEER1: length 109.5
  Bottom Layer w0.508: H1.5 66.36,65.62 53.59,52.86 19.81,52.86 16,49.05 16,11.71 10.68,6.38 CN1.1
STEER2: length 94.8
  Bottom Layer w0.508: CN2.1 28.07,1.8 28.07,13.36 35.18,20.47 35.18,45.62 38.86,49.3 66.93,49.3 68.94,51.31 68.94,63.08
STEER3: length 80
  Bottom Layer w0.508: 74.02,63.08 74.02,47.75 71.5,45.23 58.17,45.23 55.88,42.95 55.88,15.39 48.29,7.8 CN3.1
STEER4: length 67.9
  Bottom Layer w0.508: H1.1 76.33,63.31 76.33,12.98 69.37,6.02 CN4.1
$1N401: length 2.3
  Top Layer w0.762: R53.1 54.38,68.55 52.06,68.55
$1N405: length 1.8
  Top Layer w0.762: R2.1 3.86,59.32 U2.1
$1N1540: length 1.8
  Top Layer w0.381: R54.2 2.65,29.41 U3.4
$1N1581: length 1.7
  Top Layer w0.381: C79.1 6.71,29.66 6.58,29.54
$1N1587: length 10.7
  Top Layer w0.381: C79.2 v2(9.57,31.15)
  Bottom Layer w0.381: v2(9.57,31.15) 11.68,29.03 11.68,25.08 v2(10.04,23.44)
$1N1881: length 1.6
  Top Layer w0.381: U3.6 4.11,23.66 R55.1
$1N2036: length 1.8
  Top Layer w0.381: R55.2 3.99,20.49 2.32,20.49
$1N2040: length 13.9
  Top Layer w0.381: R74.3 1.53,16.57 R57.2 0.49,17.63 0.49,22.15 2.06,23.72 U3.5
$1N2151: length 1.9
  Top Layer w0.762: R58.1 4.2,1.72 STRPWR1.2
$1N2280: length 8.2
  Top Layer w0.381: R56.1 9.87,14.88 R74.1 R74.2
$1N3136: length 2.2
  Top Layer w0.381: R59.2 22.28,31.73 U4.4
$1N3138: length 1.7
  Top Layer w0.381: C85.1 26.25,31.85 U4.1
$1N3142: length 7.4
  Top Layer w0.381: 27.65,33.32 v2(27.65,31.67)
  Bottom Layer w0.381: v2(27.71,25.95) 27.65,26.02 v2(27.65,31.67)
$1N3159: length 1.7
  Top Layer w0.381: R60.1 23.53,25.86 23.57,25.89
$1N3163: length 2
  Top Layer w0.381: R60.2 23.46,22.64 C49.2 21.59,22.64
$1N3165: length 12.5
  Top Layer w0.381: 22.3,25.89 20.57,24.17 20.57,19.95 R62.2 21,15.82 R76.3
$1N3182: length 1.8
  Top Layer w0.762: STRPWR2.2 23.03,1.89 R63.1
$1N3186: length 6.3
  Top Layer w0.381: R76.2 R76.1 25.97,13.8 R61.1
$1N3910: length 1.9
  Top Layer w0.381: U5.4 40.31,31.02 R64.2
$1N3912: length 1.9
  Top Layer w0.381: U5.1 46.19,31.21 C81.1
$1N3916: length 7.5
  Top Layer w0.381: C81.2 v2(47.59,31.29)
  Bottom Layer w0.381: v2(47.59,31.29) v2(47.59,25.32)
$1N3933: length 1.5
  Top Layer w0.381: R65.1 43.51,25.15 U5.6
$1N3937: length 1.7
  Top Layer w0.381: R65.2 C58.2
$1N3939: length 14.1
  Top Layer w0.381: R75.3 42.07,14.02 R67.2 42.19,17.44 U5.5
$1N3956: length 2.1
  Top Layer w0.762: STRPWR3.2 43.52,1.81 R68.1
$1N3960: length 6.7
  Top Layer w0.381: 42.57,9.44 R75.1 45.87,12.74 R66.1
$1N4684: length 2.7
  Top Layer w0.381: U6.4 59.63,30.69 59.08,31.24 59.08,31.93
$1N4686: length 1.7
  Top Layer w0.381: U6.1 64.78,30.75 C89.1
$1N4690: length 7.4
  Top Layer w0.381: C89.2 66.19,32.34 v2(66.19,30.78)
  Bottom Layer w0.381: v2(66.19,30.78) v2(66.19,24.94)
$1N4707: length 1.6
  Top Layer w0.381: 62.18,24.88 62.18,23.37 62.14,23.33
$1N4711: length 1.7
  Top Layer w0.381: 62.14,21.82 62.14,20.35 62.13,20.34 C67.2
$1N4713: length 14
  Top Layer w0.381: R77.3 60.75,12.81 R72.2 60.91,16.89 60.91,24.88
$1N4730: length 2
  Top Layer w0.762: R73.1 64.48,1.59 STRPWR4.2
$1N4734: length 9
  Top Layer w0.381: R71.1 66.84,9.14 R77.1 R77.2
$1N12422: length 3.6
  Top Layer w0.762: R113.1 31.24,65.95 D44.1 32.91,66.05 R114.2
$1N12444: length 1.7
  Top Layer w0.762: R114.1 34.59,68.13 Q2.1
$1N14719: length 1.7
  Top Layer w0.762: R128.1 C140.2
$1N14792: length 1.7
  Top Layer w0.762: R129.1 8.75,64.7 C141.2

## Copper pours and planes (outline as drawn; the poured copper is in the pictures)
GND on Top Layer: -3.56,75.59 87.25,75.59 87.25,-2.9 -3.56,-2.9
GND on Bottom Layer: -4.44,74.44 82.93,74.44 82.93,-4.04 -4.44,-4.04
GND on GND: 0.26,69.74 79.74,69.74 79.74,0.26 0.26,0.26
GND on VCCBAT: -3.17,74.19 85.22,74.19 85.22,-4.29 -3.17,-4.29
VCC on Top Layer: 62.09,44.46 19.15,44.46 17.84,43.15 0.25,43.15 0.25,55.27 42.54,55.27 43.13,55.86 43.13,60.43 41.24,60.43 41.24,67.59 57.66,67.59 59.69,65.56 64.26,65.56 64.19,65.48 64.19,60.8 62.09,58.71
VCCBAT on Top Layer: 15.88,57.17 5.93,57.17 4.83,58.27 3.2,58.27 2.99,58.07 2.99,55.42 39.88,55.42 39.88,63.27 35.94,63.27 35.94,66.57 33.91,66.57 33.91,63.65 30.05,63.65 30.05,64.97 29.97,65.05 23.75,65.05
VCCSTEER1 on Top Layer: 9.15,8.38 10.9,8.38 10.9,15.69 17.89,15.69 17.89,5.38 14.74,2.23 14.74,0.19 11.88,0.19 11.88,3.04 9.15,3.04
VCCSTEER2 on Top Layer: 37.24,12.75 33.13,8.64 33.07,3.17 31.6,3.17 31.6,0.37 29.11,0.37 29.11,3.18 26.32,3.18 26.32,12.76 28.09,12.76 28.09,15.16 37.24,15.16
VCCSTEER3 on Top Layer: 56.57,10.92 53.62,7.97 53.62,3.22 52.1,1.7 52.1,0.04 49.4,0.04 49.4,3.18 46.67,3.18 46.67,11.6 48.79,11.6 48.79,14.4 56.57,14.4
VCCSTEER4 on Top Layer: 79.28,13.63 79.28,9.62 78.18,8.52 75.43,8.52 75.43,4.07 73.43,2.08 73.43,0.3 70.43,0.3 70.43,2.84 67.59,2.84 67.59,12.37 74.15,12.37 75.42,13.63 79.27,13.63
$1N407 on Top Layer: 7.49,63.97 9.53,63.97 9.91,64.35 9.91,66.83 14.73,66.83 14.73,57.46 5.81,57.46 5.81,61.21 7.49,62.89
$1N408 on Top Layer: 15.01,60.5 18.82,60.5 23.5,65.17 30.03,65.17 30.05,65.2 30.05,69.63 14.99,69.63 14.99,60.51
$1N1587 on Top Layer: 5.86,24.34 5.86,17.09 11.07,17.09 11.07,24.34
$1N1783 on Top Layer: 11.44,16.46 11.44,22.98 13.39,22.98 13.39,30.69 20.06,30.69 20.06,18.86 17.96,16.46
$1N2319 on Top Layer: 6.14,28.86 6.14,33.43 7.79,35.08 7.79,42.19 0.42,42.19 0.42,38.26 4.49,34.19 4.49,28.86
$1N3142 on Top Layer: 25.55,26.46 25.55,25.54 24.53,24.51 24.53,18.72 24.54,18.71 29.24,18.71 29.24,26.44 29.21,26.46
$1N3154 on Top Layer: 29.62,25.19 29.62,15.58 36.35,15.58 39.4,18.63 39.4,33.08 32.92,33.08 32.92,27.03 31.08,25.19
$1N3195 on Top Layer: 19.68,44.28 19.68,40.97 24.16,36.49 24.16,30.47 25.5,30.47 25.55,30.53 25.55,33.7 25.81,33.95 25.81,35.33 26.03,35.55 26.7,35.55 26.7,38.91 27.59,39.8 27.59,44.28
$1N3916 on Top Layer: 45.62,25.95 45.62,24.94 44.73,24.05 44.73,17.57 49.3,17.57 49.3,26.07 45.73,26.07
$1N3928 on Top Layer: 52.22,30.78 52.22,24.05 50.95,22.78 49.62,22.78 49.62,14.77 56.34,14.77 58.83,17.27 58.83,30.78
$1N3969 on Top Layer: 45.44,30.21 45.44,33.28 45.87,33.72 45.87,35.11 46.47,35.71 46.47,38.24 47.02,38.78 47.02,43.48 39.46,43.48 39.46,39.88 44,35.35 44,30.3 43.97,30.27 44.03,30.21
$1N4690 on Top Layer: 64.03,25.73 64.03,12.49 69.62,12.49 69.62,20.11 67.84,21.89 67.84,25.7 67.81,25.73
$1N4702 on Top Layer: 72.56,29.86 72.56,19.62 71.66,18.71 69.88,18.71 69.88,12.57 74.07,12.57 75.31,13.81 79.4,13.81 79.4,29.86 79.4,29.86
$1N4743 on Top Layer: 56.42,43.06 56.42,41.57 62.76,35.22 62.76,29.83 64.1,29.83 64.16,29.89 64.16,32.95 64.76,33.55 64.76,43.06
$1N12432 on Top Layer: 35.99,63.54 40.08,63.54 40.08,67.12 38.57,67.12 38.57,69.52 35.99,69.52

Small or netless copper shapes (teardrops, artwork), in the pictures only: 111 on Top Layer, 16 on Bottom Layer, 7 on VCCBAT

## Text on the board
Top Silkscreen Layer: CH2 | CH1 | G | CH4 | CH3 | GND | 12V
